# EAGLE design STM32_Rauch_002 (EAGLE 7.7.0)

## Sheet 1 of 2
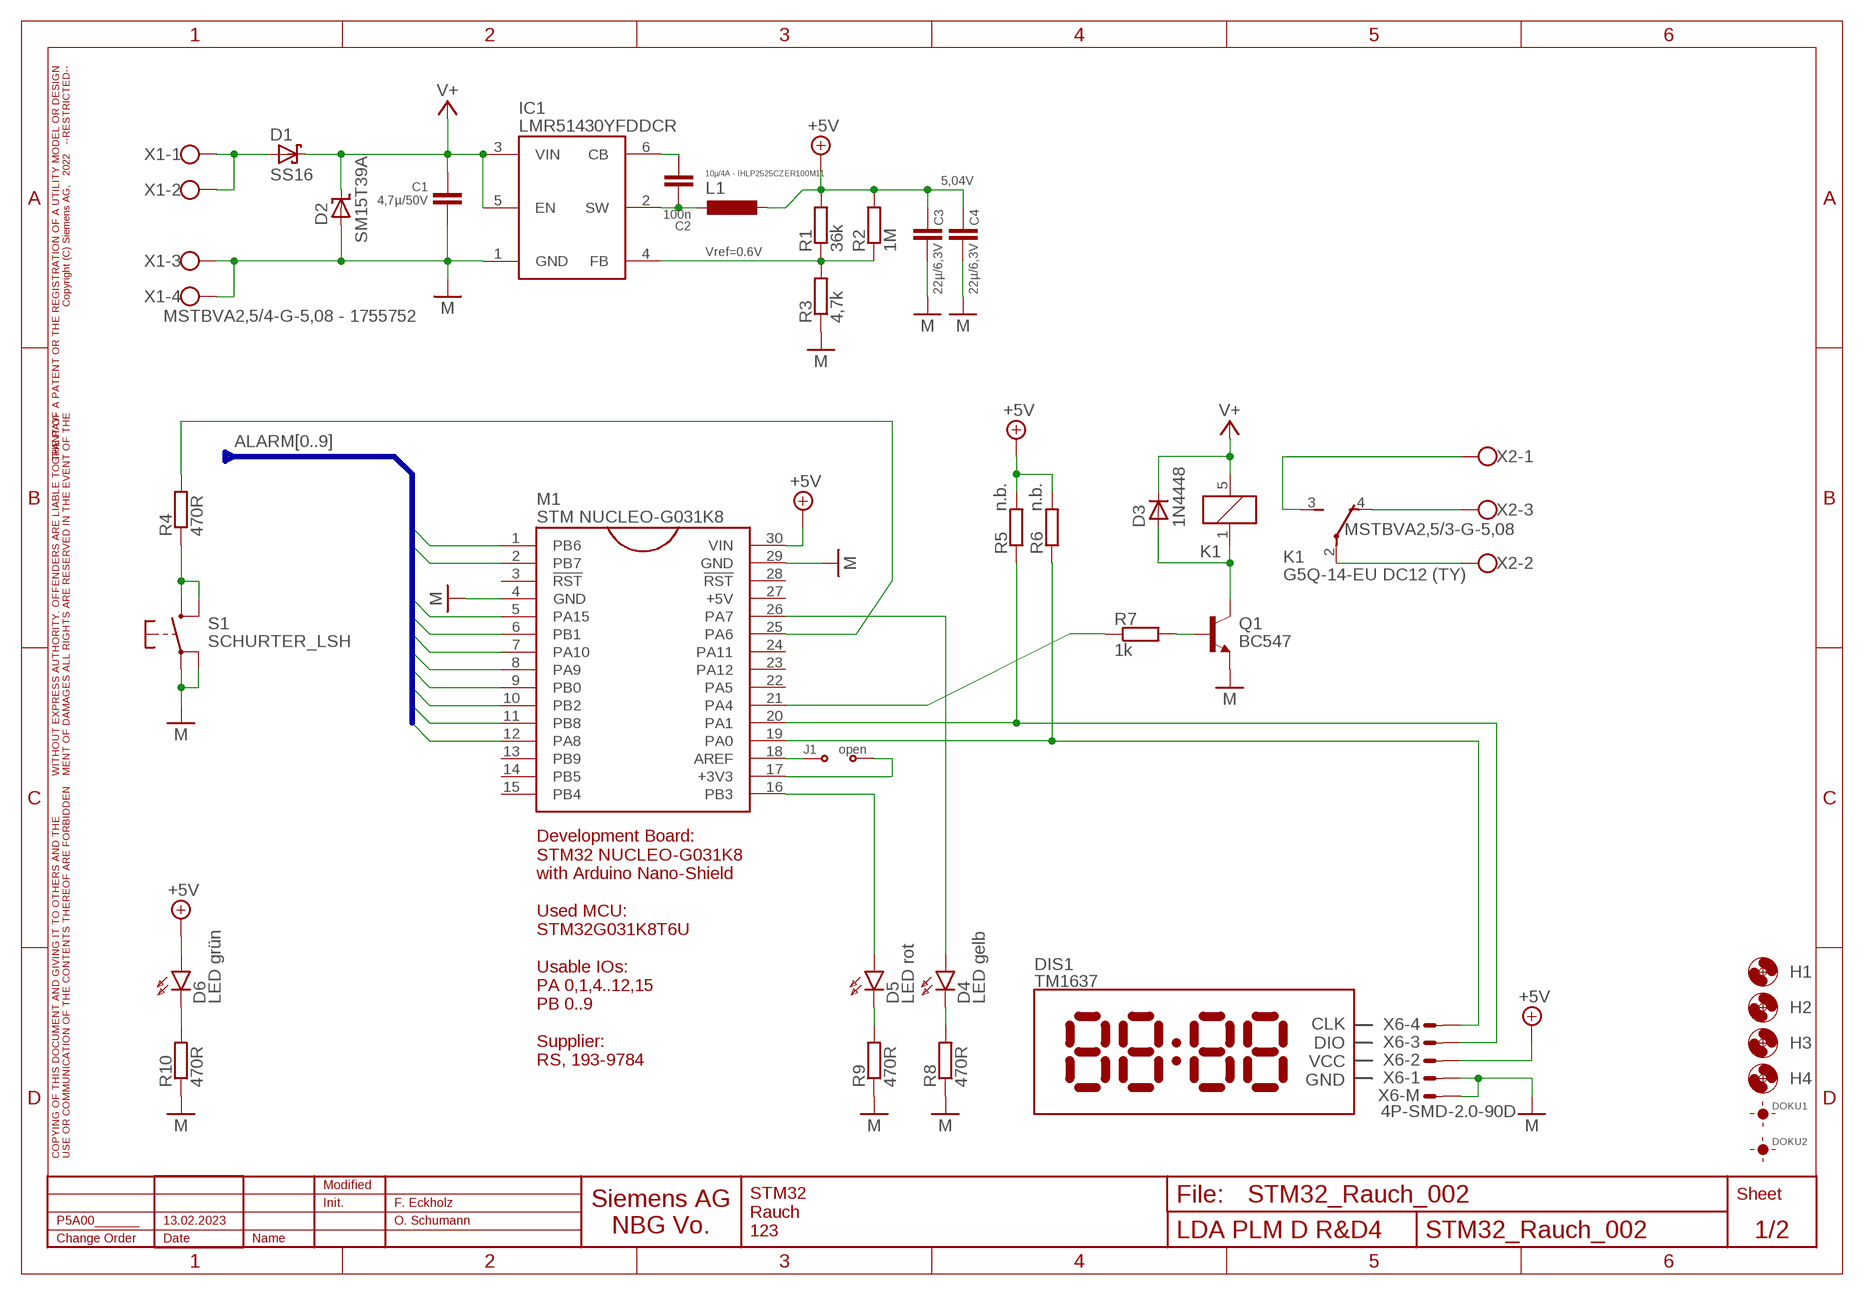
[diagram p0: schematic, sheet 1]

### Parts
C1  4,7µ/50V  C-EU1210  [CAPC1210]
C2  100n  C-EU0603  [CAPC0603]
C3  22µ/6,3V  C-EU1206  [CAPC1206]
C4  22µ/6,3V  C-EU1206  [CAPC1206]
D1  SS16  DIODE-SCHOTTKY-SMA  [DIOM-SMA]
D2  SM15T39A  DIODE-TVS-UNI-SMC  [DIOM-SMC]
D3  1N4448  DIODE-SOD323  [SOD323]
D4  LED gelb  DIODE-LED-C1608  [LEDC1608]
D5  LED rot  DIODE-LED-C1608  [LEDC1608]
D6  LED grün  DIODE-LED-C1608  [LEDC1608]
DIS1  TM1637  [TM1637]
DOKU1  PAD-FIDU-R200  [FIDU_RUND-2MM]
DOKU2  PAD-FIDU-R200  [FIDU_RUND-2MM]
DOKU4  STM32_Rauch_002  TEXT-50-TOP  [DOKU-50-TOP]
H1  MOUNT-HOLE-3.2  [MOUNT-HOLE-3,2]
H2  MOUNT-HOLE-3.2  [MOUNT-HOLE-3,2]
H3  MOUNT-HOLE-3.2  [MOUNT-HOLE-3,2]
H4  MOUNT-HOLE-3.2  [MOUNT-HOLE-3,2]
IC1  LMR51430YFDDCR  LMR51430  [SOT23-6]
J1  open  CON-J2D  [CON-SOLDERJUMPER]
K1  G5Q-14-EU DC12 (TY)  RELAIS1-OMRON-G5Q  [OMRON-G5Q]
L1  10µ/4A - IHLP2525CZER100M11  L-EU0707  [INDM0707]
M1  STM NUCLEO-G031K8  STM32-NUCLEO32  [NUCLEO32]
Q1  BC547  TRANSISTOR-NPN-SOT23  [SOT23]
R1  36k  R-EU_0603  [RESC0603]
R2  1M  R-EU_0603  [RESC0603]
R3  4,7k  R-EU_0603  [RESC0603]
R4  470R  R-EU_0603  [RESC0603]
R5  n.b.  R-EU_0603  [RESC0603]
R6  n.b.  R-EU_0603  [RESC0603]
R7  1k  R-EU_0603  [RESC0603]
R8  470R  R-EU_0603  [RESC0603]
R9  470R  R-EU_0603  [RESC0603]
R10  470R  R-EU_0603  [RESC0603]
S1  SCHURTER_LSH  [SHURTER_LSH]
X1  MSTBVA2,5/4-G-5,08 - 1755752  MSTBVA2,5/4-G-5,08  [MSTBVA2,5/4-G-5,08]
X2  MSTBVA2,5/3-G-5,08  [MSTBVA2,5/3-G-5,08]
X6  4P-SMD-2.0-90D  [4P-SMD-2.0-90D]

### Nets
!RESET: M1.25(PA6) R4.2
+5V: C3.2 C4.2 D6.2(A) L1.2 M1.30(VIN) R1.2 R2.2 R5.2 R6.2 X6.2 ; also sheet 2
ALARM0: M1.1(PB6) ; also sheet 2
ALARM1: M1.2(PB7) ; also sheet 2
ALARM2: M1.5(PA15) ; also sheet 2
ALARM3: M1.6(PB1) ; also sheet 2
ALARM4: M1.7(PA10) ; also sheet 2
ALARM5: M1.8(PA9) ; also sheet 2
ALARM6: M1.9(PB0) ; also sheet 2
ALARM7: M1.10(PB2) ; also sheet 2
ALARM8: M1.11(PB8) ; also sheet 2
ALARM9: M1.12(PA8) ; also sheet 2
M: C1.1 C3.1 C4.1 D2.2(A) IC1.1(GND) M1.4(GND) M1.29(GND) Q1.2(E) R3.1 R8.1 R9.1 R10.1 S1.1(P) S1.2(P) X1.3 X1.4 X6.1 X6.SS1 X6.SS2 ; also sheet 2
N$1: D3.A K1.1(C:COIL1) Q1.3(C)
N$2: D1.2(A) X1.1 X1.2
N$3: R4.1 S1.3(S) S1.4(S)
N$6: D4.1(C) R8.2
N$7: Q1.1(B) R7.2
N$8: D5.1(C) R9.2
N$9: M1.21(PA4) R7.1
N$10: C2.1 IC1.6(CB)
N$11: C2.2 IC1.2(SW) L1.1
N$12: IC1.4(FB) R1.1 R2.1 R3.2
N$13: K1.2(R:C) X2.2
N$14: K1.3(R:NO) X2.1
N$15: K1.4(R:NC) X2.3
N$16: M1.19(PA0) R6.1 X6.4
N$18: D6.1(C) R10.2
N$19: J1.1 M1.18(AREF)
N$20: M1.20(PA1) R5.1 X6.3
N$21: D4.2(A) M1.26(PA7)
N$30: D5.2(A) M1.16(PB3)
N$63: J1.2 M1.17(+3V3)
V+: C1.2 D1.1(K) D2.1(C) D3.C IC1.3(VIN) IC1.5(EN) K1.5(C:COIL2) ; also sheet 2
Unconnected: M1.3(!RST) M1.13(PB9) M1.14(PB5) M1.15(PB4) M1.22(PA5) M1.23(PA12) M1.24(PA11) M1.27(+5V) M1.28(!RST)

### Buses
ALARM[0..9]

### Notes on the sheet
- 5,04V
- Vref=0.6V
- Development Board:
  STM32 NUCLEO-G031K8
  with Arduino Nano-Shield
  
  Used MCU:
  STM32G031K8T6U
  
  Usable IOs:
  PA 0,1,4..12,15
  PB 0..9
  
  Supplier:
  RS, 193-9784
- F. Eckholz
- STM32
  Rauch
  123
- P5A00______ | 13.02.2023 | O. Schumann

## Sheet 2 of 2
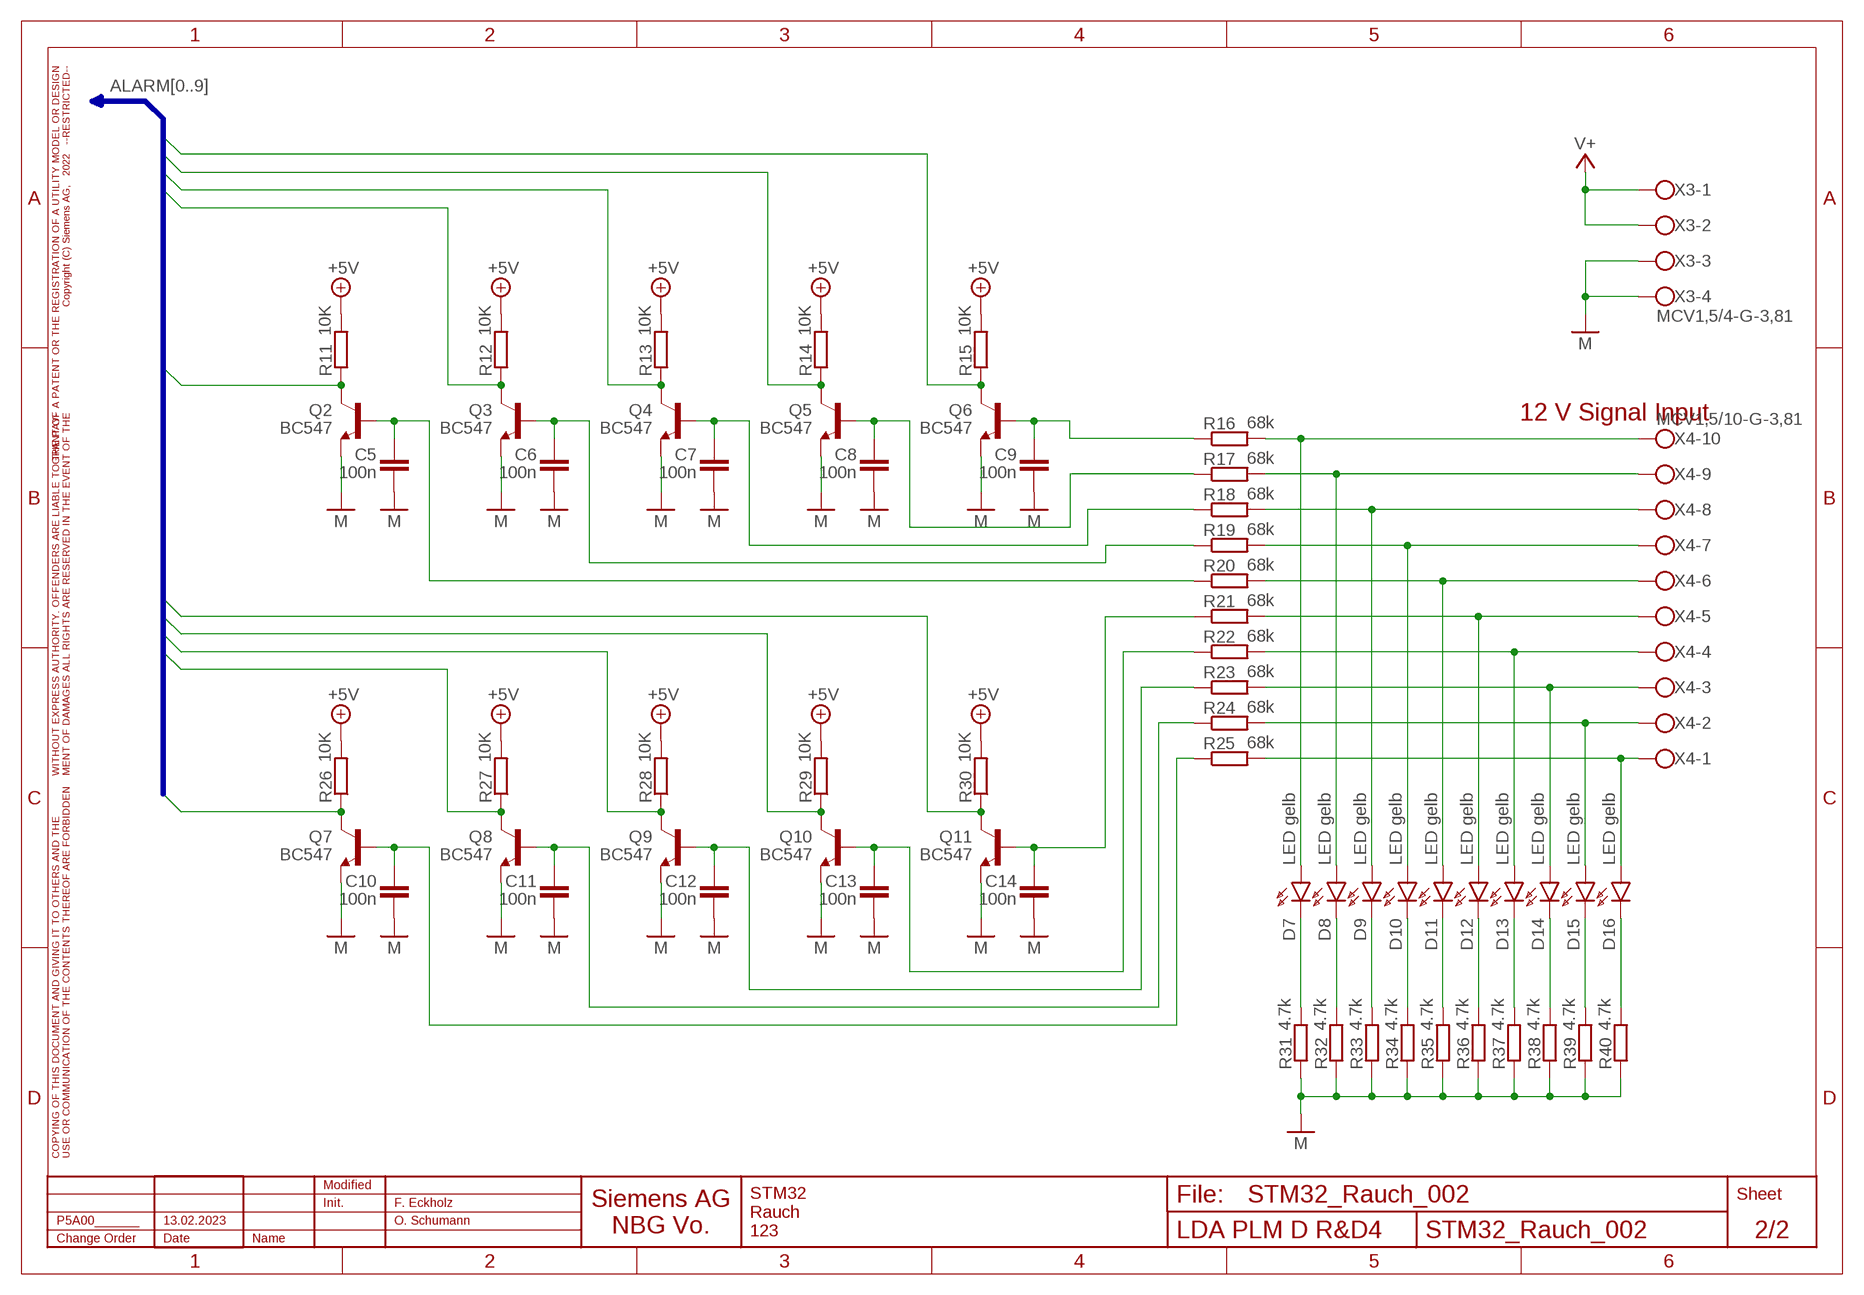
[diagram p1: schematic, sheet 2]

### Parts
C5  100n  C-EU0603  [CAPC0603]
C6  100n  C-EU0603  [CAPC0603]
C7  100n  C-EU0603  [CAPC0603]
C8  100n  C-EU0603  [CAPC0603]
C9  100n  C-EU0603  [CAPC0603]
C10  100n  C-EU0603  [CAPC0603]
C11  100n  C-EU0603  [CAPC0603]
C12  100n  C-EU0603  [CAPC0603]
C13  100n  C-EU0603  [CAPC0603]
C14  100n  C-EU0603  [CAPC0603]
D7  LED gelb  DIODE-LED-C1608  [LEDC1608]
D8  LED gelb  DIODE-LED-C1608  [LEDC1608]
D9  LED gelb  DIODE-LED-C1608  [LEDC1608]
D10  LED gelb  DIODE-LED-C1608  [LEDC1608]
D11  LED gelb  DIODE-LED-C1608  [LEDC1608]
D12  LED gelb  DIODE-LED-C1608  [LEDC1608]
D13  LED gelb  DIODE-LED-C1608  [LEDC1608]
D14  LED gelb  DIODE-LED-C1608  [LEDC1608]
D15  LED gelb  DIODE-LED-C1608  [LEDC1608]
D16  LED gelb  DIODE-LED-C1608  [LEDC1608]
Q2  BC547  TRANSISTOR-NPN-SOT23  [SOT23]
Q3  BC547  TRANSISTOR-NPN-SOT23  [SOT23]
Q4  BC547  TRANSISTOR-NPN-SOT23  [SOT23]
Q5  BC547  TRANSISTOR-NPN-SOT23  [SOT23]
Q6  BC547  TRANSISTOR-NPN-SOT23  [SOT23]
Q7  BC547  TRANSISTOR-NPN-SOT23  [SOT23]
Q8  BC547  TRANSISTOR-NPN-SOT23  [SOT23]
Q9  BC547  TRANSISTOR-NPN-SOT23  [SOT23]
Q10  BC547  TRANSISTOR-NPN-SOT23  [SOT23]
Q11  BC547  TRANSISTOR-NPN-SOT23  [SOT23]
R11  10K  R-EU_0603  [RESC0603]
R12  10K  R-EU_0603  [RESC0603]
R13  10K  R-EU_0603  [RESC0603]
R14  10K  R-EU_0603  [RESC0603]
R15  10K  R-EU_0603  [RESC0603]
R16  68k  R-EU_0603  [RESC0603]
R17  68k  R-EU_0603  [RESC0603]
R18  68k  R-EU_0603  [RESC0603]
R19  68k  R-EU_0603  [RESC0603]
R20  68k  R-EU_0603  [RESC0603]
R21  68k  R-EU_0603  [RESC0603]
R22  68k  R-EU_0603  [RESC0603]
R23  68k  R-EU_0603  [RESC0603]
R24  68k  R-EU_0603  [RESC0603]
R25  68k  R-EU_0603  [RESC0603]
R26  10K  R-EU_0603  [RESC0603]
R27  10K  R-EU_0603  [RESC0603]
R28  10K  R-EU_0603  [RESC0603]
R29  10K  R-EU_0603  [RESC0603]
R30  10K  R-EU_0603  [RESC0603]
R31  4.7k  R-EU_0603  [RESC0603]
R32  4.7k  R-EU_0603  [RESC0603]
R33  4.7k  R-EU_0603  [RESC0603]
R34  4.7k  R-EU_0603  [RESC0603]
R35  4.7k  R-EU_0603  [RESC0603]
R36  4.7k  R-EU_0603  [RESC0603]
R37  4.7k  R-EU_0603  [RESC0603]
R38  4.7k  R-EU_0603  [RESC0603]
R39  4.7k  R-EU_0603  [RESC0603]
R40  4.7k  R-EU_0603  [RESC0603]
X3  MCV1,5/4-G-3,81  [MCV1,5/4-G-3,81]
X4  MCV1,5/10-G-3,81  [MCV1,5/10-G-3,81]

### Nets
+5V: R11.2 R12.2 R13.2 R14.2 R15.2 R26.2 R27.2 R28.2 R29.2 R30.2 ; also sheet 1
ALARM0: Q6.3(C) R15.1 ; also sheet 1
ALARM1: Q5.3(C) R14.1 ; also sheet 1
ALARM2: Q4.3(C) R13.1 ; also sheet 1
ALARM3: Q3.3(C) R12.1 ; also sheet 1
ALARM4: Q2.3(C) R11.1 ; also sheet 1
ALARM5: Q11.3(C) R30.1 ; also sheet 1
ALARM6: Q10.3(C) R29.1 ; also sheet 1
ALARM7: Q9.3(C) R28.1 ; also sheet 1
ALARM8: Q8.3(C) R27.1 ; also sheet 1
ALARM9: Q7.3(C) R26.1 ; also sheet 1
M: C5.1 C6.1 C7.1 C8.1 C9.1 C10.1 C11.1 C12.1 C13.1 C14.1 Q2.2(E) Q3.2(E) Q4.2(E) Q5.2(E) Q6.2(E) Q7.2(E) Q8.2(E) Q9.2(E) Q10.2(E) Q11.2(E) R31.1 R32.1 R33.1 R34.1 R35.1 R36.1 R37.1 R38.1 R39.1 R40.1 X3.P$3 X3.P$4 ; also sheet 1
N$4: D7.2(A) R16.2 X4.P$10
N$5: D7.1(C) R31.2
N$17: C14.2 Q11.1(B) R21.1
N$22: D14.2(A) R23.2 X4.P$3
N$23: C13.2 Q10.1(B) R22.1
N$24: D8.2(A) R17.2 X4.P$9
N$25: D9.2(A) R18.2 X4.P$8
N$26: D10.2(A) R19.2 X4.P$7
N$27: D11.2(A) R20.2 X4.P$6
N$28: D12.2(A) R21.2 X4.P$5
N$29: D13.2(A) R22.2 X4.P$4
N$31: D15.2(A) R24.2 X4.P$2
N$32: D16.2(A) R25.2 X4.P$1
N$34: D8.1(C) R32.2
N$35: D9.1(C) R33.2
N$36: D10.1(C) R34.2
N$37: D11.1(C) R35.2
N$38: D12.1(C) R36.2
N$39: D13.1(C) R37.2
N$41: C12.2 Q9.1(B) R23.1
N$42: D14.1(C) R38.2
N$44: D15.1(C) R39.2
N$46: C11.2 Q8.1(B) R24.1
N$47: D16.1(C) R40.2
N$50: C9.2 Q6.1(B) R16.1
N$53: C8.2 Q5.1(B) R17.1
N$56: C7.2 Q4.1(B) R18.1
N$59: C6.2 Q3.1(B) R19.1
N$62: C10.2 Q7.1(B) R25.1
N$66: C5.2 Q2.1(B) R20.1
V+: X3.P$1 X3.P$2 ; also sheet 1

### Buses
ALARM[0..9]

### Notes on the sheet
- 12 V Signal Input
- F. Eckholz
- STM32
  Rauch
  123
- P5A00______ | 13.02.2023 | O. Schumann

## Library data of the parts
C1-C14 = rcl smd:C-EU: CAPACITOR, European symbol
D1 = diode:DIODE-SCHOTTKY
D2 = diode:DIODE-TVS-UNI
D3 = diode:DIODE
D4-D16 = diode:DIODE-LED
DIS1 = Arduino:TM1637: TM1637
DOKU1 DOKU2 = info:PAD-FIDU: Fiducial = Passermarke Auszug aus: "R 5.4.4 Automatengerechtes Design von Leiterplatten" der Firma Bischof Elektronik Rev 0 Optische Marken für Leiterplatten-Lageerkennung - Anordnung von mind. 2 Marken pro Einzelschaltung bei SMD-bestückten Layern - zusätzlich min. 2 Marken , möglichst 4 auf technolog. Rand bei Nutzen-Gestaltung, jedoch nicht symmetriesch wegen Verdrehgefahr beim Einstapeln der LP in Magazin - Marken möglichst diagonal mit größtmöglichem Abstand positionieren, jedoch nicht im o.g. Randbereich von 5 mm - alle Referenzmarken einer Leiterplatte sollten möglichst gleiche Geometrie haben - bei großen hochpoligen Fine-Pitch-Bauteilen sind je Bauteil 2 zusätzliche, lokale Referenzmarken in unmittelbarer Nähe und möglichst diagonal-symetrisch anzuordnen Markenform: Vollkreis oder Vollquadrat 1 bis 2,0 mm sind am günstigsten keine Überdeckung mit Lötstoplack; Lötstopp-Lackfrei ca. Durchmesser 5 mm Leiterbildstrukturen sollten einen Mindestabstand von 5mm zur Marke einhalten.; BOM: EXCLUDE
DOKU4 = frames:TEXT: Textfeld für Dokumentation Als Value im Schaltplan und Board; BOM: EXCLUDE
H1-H4 = con-pad:MOUNT-HOLE: Mounting Hole
IC1 = sda_test:LMR51430: LMR51430 SIMPLE SWITCHER® 4.5-V to 36-V, 3-A, Synchronous Buck Converter in a SOT-23 Package Part Number Frequency Mode LMR51430XDDCR 500 kHz PFM LMR51430XFDDCR 500 kHz FPWM LMR51430YDDCR 1.1 MHz PFM LMR51430YFDDCR 1.1 MHz FPWM
J1 = con-div:CON-J2: Jumper 2pol.
K1 = relais:RELAIS1
L1 = rcl smd:L-EU: INDUCTOR, European symbol
M1 = Arduino:STM32: Arduino Nano plug in module with SMT32 Nucleo-32 signal names
Q1-Q11 = transistor:TRANSISTOR-NPN
R1-R40 = rcl smd:R-EU_: RESISTOR, European symbol
S1 = switch:SCHURTER
X1 = con-phoenix:MSTBVA2,5/4-G-5,08: Phoenix Contact Artikelbezeichnung MSTBVA2,5/4-G-5,08 Artikelnummer 1755752 COMBICON-Typ Grundgehäuse Anschlussdaten 320V 12A Rastermaß [mm] 5,08 Im Raster anreihbar nein Maximale Bauhöhe [mm] siehe Gegenstück o.schumann@isle-ilmenau.de
X2 = con-phoenix:MSTBVA2,5/3-G-5,08: Phoenix Contact Artikelbezeichnung MSTBVA2,5/3-G-5,08 Artikelnummer 1755749 COMBICON-Typ Grundgehäuse Anschlussdaten 320V 12A Rastermaß [mm] 5,08 Im Raster anreihbar nein Maximale Bauhöhe [mm] siehe Gegenstück o.schumann@isle-ilmenau.de
X3 = con-phoenix:MCV1,5/4-G-3,81: Phoenix Contact Artikelbezeichnung MCV 1,5/4-G-3,81 Artikelnummer 1803442 COMBICON-Typ Printklemme Anschlussdaten 160V 8A Rastermaß [mm] 3,81 Im Raster anreihbar nein Maximale Bauhöhe [mm] keine Ahnung o.schumann@isle-ilmenau.de
X4 = con-phoenix:MCV1,5/10-G-3,81: Phoenix Contact Artikelbezeichnung MCV 1,5/10-G-3,81 Artikelnummer 1803507 COMBICON-Typ Printklemme Anschlussdaten 160V 8A Rastermaß [mm] 3,81 Im Raster anreihbar nein Maximale Bauhöhe [mm] keine Ahnung oliver.schumann@siemens.com
X6 = Arduino:4P-SMD-2.0-90D

## Net classes
0 default: width 0.3 mm, drill 0.3 mm, clearance 0.203 mm
1 Diff_pair: clearance 0.152 mm

## Board
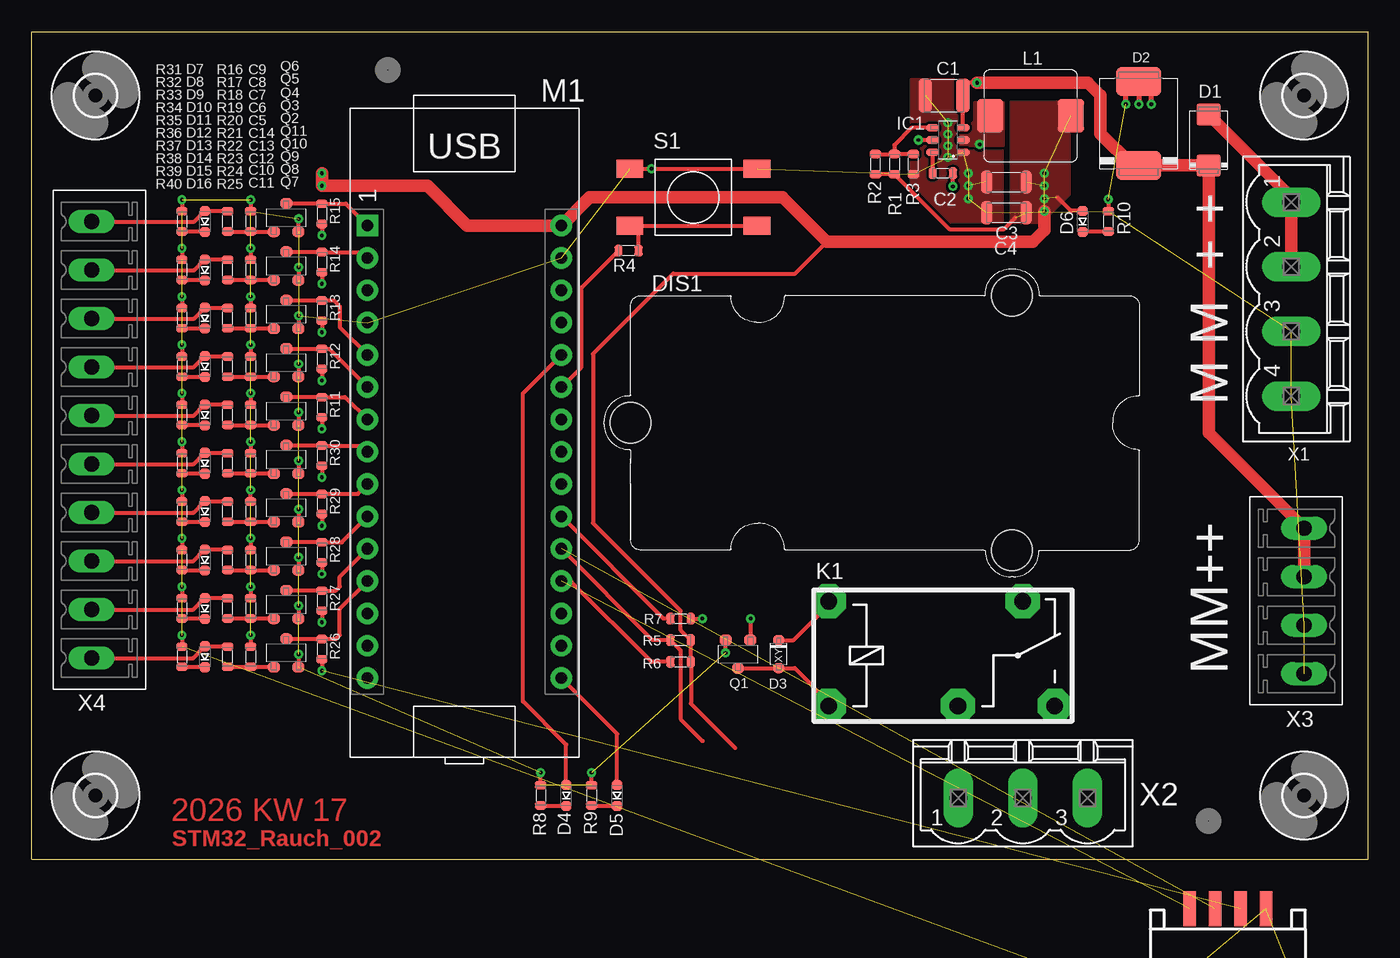
[diagram p2: board, top side]
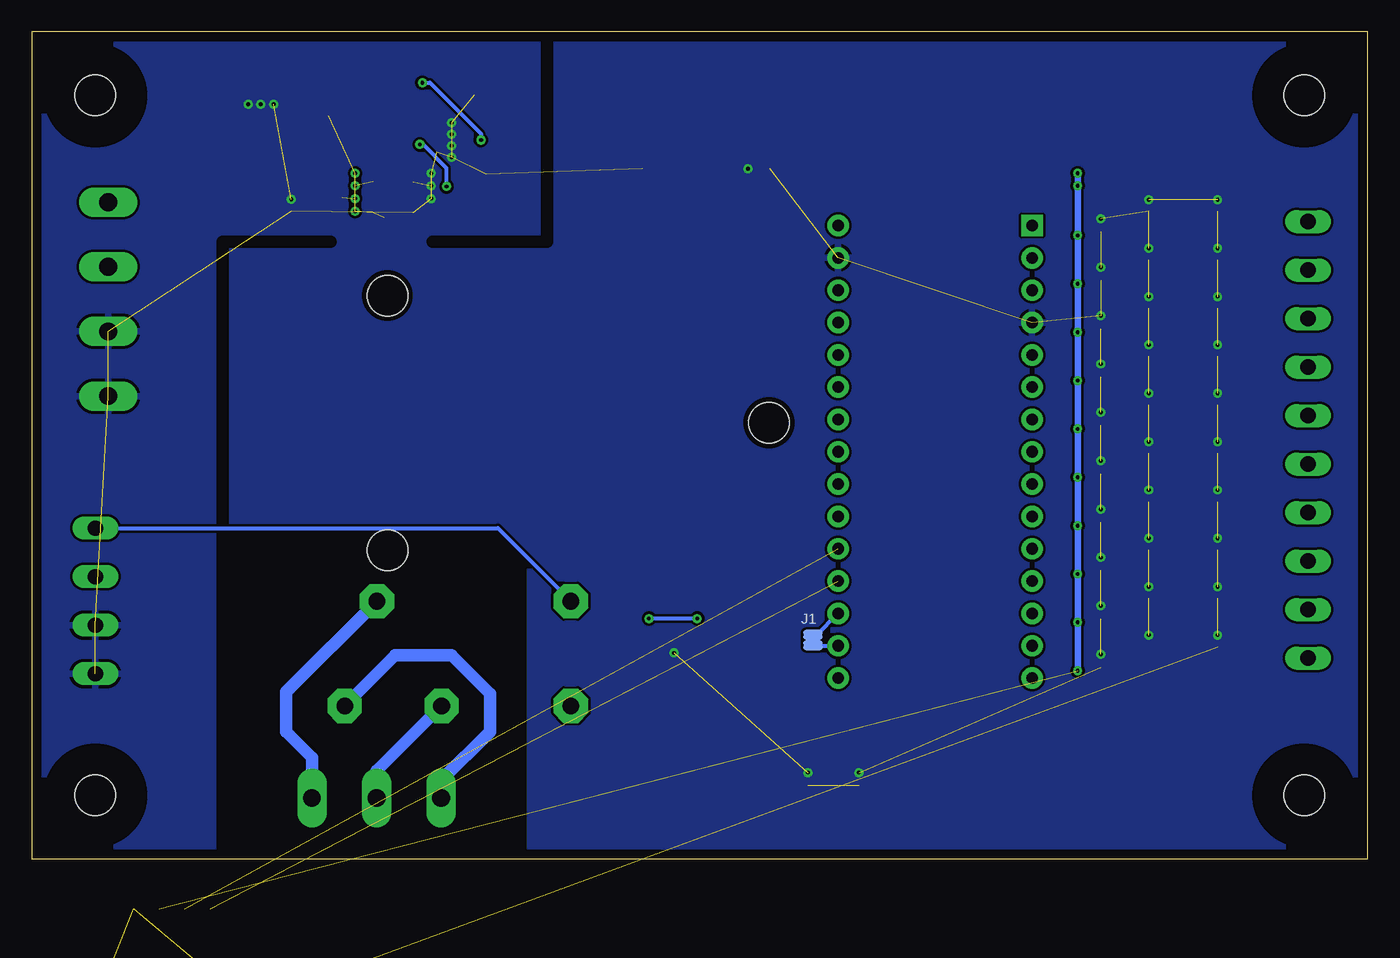
[diagram p3: board, bottom side, seen from below]

Size 105 x 65 mm. Coordinates in mm from the lower left corner, seen from the top.
Outline: 0,0 0,65 105,65 105,0 0,0
Copper layers (1+16): Top 0.035mm / dielectric 0.36mm / Bottom 0.035mm
Design rules "default *": minimum track width 0.1mm, minimum drill 0.3mm, track to track 6mil, track to pad 6mil, pad to pad 8mil, via to via 8mil, smd to smd 8mil, copper to edge 0.4mm, drill to drill 8mil, minimum pad ring 10mil, minimum via ring 8mil, stop-mask expansion 4mil, vias tented up to drill 0mil, thermal gap 10mil
tRestrict: 3 lines
bRestrict: 6 lines

### Footprints (pad centres in the part's own frame; a part is rotated, then mirrored left to right if it is on the bottom)
CAPC1210 = smd 1.04 x 2.667: 1 -1.48,0; 2 1.48,0
CAPC0603 = smd 0.635 x 0.889: 1 -0.794,0; 2 0.794,0
CAPC1206 = smd 0.889 x 1.841: 1 -1.556,0; 2 1.556,0
DIOM-SMA = smd 1.7 x 1.85: 1 -2,0; 2 2,0
DIOM-SMC = smd 2.286 x 3.556: 1 -3.302,0; 2 3.302,0
SOD323 = smd 0.78 x 0.85: A 1.101,0; C -1.101,0
LEDC1608 = smd 0.8 x 0.8: 1 -0.825,0; 2 0.825,0
TM1637 = hole 3.2: 10.453,-10.42; 10.453,9.58; -19.535,-0.415
MOUNT-HOLE-3,2 = hole 3.2: 0,0
SOT23-6 = smd 1.027 x 0.6: 1 -1.2,0.95; 2 -1.2,0; 3 -1.2,-0.95; 4 1.2,-0.95; 5 1.2,0; 6 1.2,0.95
CON-SOLDERJUMPER = smd 1.5 x 0.75: 1 0,0.425; 2 0,-0.4
OMRON-G5Q = drill 1.3 pad 2.7 octagon: 1 -8.97,-3.96; 2 1.19,-3.96; 3 8.81,-3.96; 4 6.27,4.26; 5 -8.97,4.26
INDM0707 = smd 2.05 x 2.6: 1 -3.175,0; 2 3.175,0
NUCLEO32 = drill 0.914 pad 1.676 square: 1 -7.62,17.78 | drill 0.914 pad 1.676: 2 -7.62,15.24; 3 -7.62,12.7; 4 -7.62,10.16; 5 -7.62,7.62; 6 -7.62,5.08; 7 -7.62,2.54; 8 -7.62,0; 9 -7.62,-2.54; 10 -7.62,-5.08; 11 -7.62,-7.62; 12 -7.62,-10.16; 13 -7.62,-12.7; 14 -7.62,-15.24; 15 -7.62,-17.78; 16 7.62,-17.78; 17 7.62,-15.24; 18 7.62,-12.7; 19 7.62,-10.16; 20 7.62,-7.62; 21 7.62,-5.08; 22 7.62,-2.54; 23 7.62,0; 24 7.62,2.54; 25 7.62,5.08; 26 7.62,7.62; 27 7.62,10.16; 28 7.62,12.7; 29 7.62,15.24; 30 7.62,17.78
SOT23 = smd 0.813 x 0.909: 1 -1.118,0.965; 2 -1.118,-0.965; 3 1.118,0
RESC0603 = smd 0.635 x 0.889: 1 -0.794,0; 2 0.794,0
SHURTER_LSH = smd 2.1 x 1.4: 1 -5,2.25; 2 5,2.25; 3 -5,-2.25; 4 5,-2.25
MSTBVA2,5/4-G-5,08 = drill 1.4 pad 2.3 long: 1 -7.62,0; 2 -2.54,0; 3 2.54,0; 4 7.62,0
MSTBVA2,5/3-G-5,08 = drill 1.4 pad 2.3 long: 1 -5.08,0; 2 0,0; 3 5.08,0
MCV1,5/4-G-3,81 = drill 1.2 long: P$1 0,0; P$2 3.81,0; P$3 7.62,0; P$4 11.43,0
MCV1,5/10-G-3,81 = drill 1.2 long: P$1 0,0; P$2 3.81,0; P$3 7.62,0; P$4 11.43,0; P$5 15.24,0; P$6 19.05,0; P$7 22.86,0; P$8 26.67,0; P$9 30.48,0; P$10 34.29,0
4P-SMD-2.0-90D = smd 0.965 x 2.74: 1 -3,-0.1; 2 -1,-0.1; 3 1,-0.1; 4 3,-0.1 | smd 2.159 x 2.184: SS1 -5.974,7.4; SS2 5.974,7.4

### Placement (x,y rotation side)
C1  71.7,60 0 top
C2  71.6,53.9 0 top
C3  76.6,53.2 0 top
C4  76.6,50.8 0 top
C5  17.2,34.9 270 top
C6  17.2,38.7 270 top
C7  17.2,42.5 270 top
C8  17.2,46.3 270 top
C9  17.2,50.1 270 top
C10  17.2,15.9 270 top
C11  17.2,19.7 270 top
C12  17.2,23.5 270 top
C13  17.2,27.3 270 top
C14  17.2,31.1 270 top
D1  92.5,56.5 90 top
D2  87,57.8 90 top
D3  58.7,16.1 270 top
D4  42,5 90 top
D5  46,5 90 top
D6  82.6,50.1 90 top
D7  13.6,50.1 90 top
D8  13.6,46.3 90 top
D9  13.6,42.5 90 top
D10  13.6,38.7 90 top
D11  13.6,34.9 90 top
D12  13.6,31.1 90 top
D13  13.6,27.3 90 top
D14  13.6,23.5 90 top
D15  13.6,19.7 90 top
D16  13.6,15.9 90 top
DIS1  66.6,34.7 0 top
DOKU1  28,62 0 top
DOKU2  92.5,3 0 top
DOKU4  11,1 0 top
H1  5,5 0 top
H2  5,60 0 top
H3  100,5 0 top
H4  100,60 0 top
IC1  72,56.5 180 top
J1  43.6,17.2 0 bottom
K1  71.6,16 0 top
L1  78.5,58.4 0 top
M1  34,32 0 top
Q1  55.5,16.1 270 top
Q2  20,35.2 90 top
Q3  20,39 90 top
Q4  20,42.8 90 top
Q5  20,46.6 90 top
Q6  20,50.4 90 top
Q7  20,16.2 90 top
Q8  20,20 90 top
Q9  20,23.8 90 top
Q10  20,27.6 90 top
Q11  20,31.4 90 top
R1  67.8,54.6 270 top
R2  66.3,54.6 270 top
R3  69.3,54.6 90 top
R4  46.9,47.8 180 top
R5  51,17.2 0 top
R6  51,15.5 0 top
R7  51,18.9 0 top
R8  40,5 270 top
R9  44,5 270 top
R10  84.6,50.1 270 top
R11  22.8,35.5 270 top
R12  22.8,39.3 270 top
R13  22.8,43.1 270 top
R14  22.8,46.9 270 top
R15  22.8,50.7 270 top
R16  15.4,50.1 90 top
R17  15.4,46.3 90 top
R18  15.4,42.5 90 top
R19  15.4,38.7 90 top
R20  15.4,34.9 90 top
R21  15.4,31.1 90 top
R22  15.4,27.3 90 top
R23  15.4,23.5 90 top
R24  15.4,19.7 90 top
R25  15.4,15.9 90 top
R26  22.8,16.5 270 top
R27  22.8,20.3 270 top
R28  22.8,24.1 270 top
R29  22.8,27.9 270 top
R30  22.8,31.7 270 top
R31  11.8,50.1 270 top
R32  11.8,46.3 270 top
R33  11.8,42.5 270 top
R34  11.8,38.7 270 top
R35  11.8,34.9 270 top
R36  11.8,31.1 270 top
R37  11.8,27.3 270 top
R38  11.8,23.5 270 top
R39  11.8,19.7 270 top
R40  11.8,15.9 270 top
S1  52,52 0 top
X1  99,44 270 top
X2  77.9,4.8 0 top
X3  100,26 270 top
X4  4.7,15.8 90 top
X6  94,-4 180 top  (outside the outline)

### Tracks (layer width: path | path; a pad name or v marks a point on that pad's centre or on a via)
!RESET
  Top 0.3: R4.2 43.2,44.89 43.2,38.66 M1.25
+5V  (via drill 0.3)  (9 unrouted)
  Top 0.3: R2.2 R1.2 72.11,49.5 76.4,49.5 77.3,50.4 | R26.2 v22.8,14.8 | R27.2 v22.8,18.6 | R28.2 v22.8,22.4 | R30.2 v22.8,30 | R29.2 v22.8,26.2 | R11.2 v22.8,33.8 | R12.2 v22.8,37.6 | R13.2 v22.8,41.4 | R14.2 v22.8,45.2 | R15.2 v22.8,49 | D6.2 81.67,50.92 80.6,52 | 55.27,8.73 51.79,12.21 R6.2 R5.2 51,17.99 51,19.5 44.1,26.4 44.1,39.7 50.4,46 60,46 62.5,48.5
  Top 1: v79.6,50.9 79.6,49.4 78.7,48.5 62.5,48.5 59,52 43.84,52 M1.30 34.22,49.78 31.1,52.9 v22.8,52.9 v22.8,53.9
  Bottom 0.5: v22.8,14.8 v22.8,18.6 v22.8,22.4 v22.8,26.2 v22.8,30 v22.8,33.8 v22.8,37.6 v22.8,41.4 v22.8,45.2 v22.8,49 v22.8,52.9 v22.8,53.9
  other vias: 79.6,53.9 79.6,52.9 79.6,51.9
  pour Top (rank 2, no thermals): 76.9,50 79.4,50 81.6,52.2 81.6,59.5 76.9,59.5
ALARM0
  Top 0.3: Q6.3 22.78,51.52 R15.1 24.67,51.49 M1.1
ALARM1
  Top 0.3: Q5.3 22.78,47.72 R14.1 25.93,47.69 M1.2
ALARM2
  Top 0.3: Q4.3 22.78,43.92 R13.1 23.71,43.89 24.2,43.4 24.2,41.8 M1.5
ALARM3
  Top 0.3: Q3.3 22.78,40.12 R12.1 23.37,40.09 M1.6
ALARM4
  Top 0.3: Q2.3 22.78,36.32 R11.1 24.63,36.29 M1.7
ALARM5
  Top 0.3: Q11.3 22.78,32.52 R30.1 25.89,32.49 M1.8
ALARM6
  Top 0.3: Q10.3 22.78,28.72 R29.1 25.61,28.69 M1.9
ALARM7
  Top 0.3: Q9.3 22.78,24.92 R28.1 24.35,24.89 M1.10
ALARM8
  Top 0.3: Q8.3 22.78,21.12 R27.1 23.89,21.09 24.2,21.4 24.2,22.2 M1.11
ALARM9
  Top 0.3: Q7.3 22.78,17.32 R26.1 23.89,17.29 24.2,17.6 24.2,19.66 M1.12
M  (via drill 0.3)  (56 unrouted)
  Top 0.3: R8.1 v40,6.8 | R9.1 v44,6.8 | S1.1 v48.7,54.25 S1.2 | v84.6,51.85 R10.1 | v54.53,16.2 Q1.2 | Q6.2 v20.96,50.3 | v20.96,46.5 Q5.2 | v17.2,48 C8.1 | v11.8,48 R32.1 | v11.8,44.2 R33.1 | v17.2,51.8 C9.1 | v11.8,51.8 R31.1 | v17.2,44.2 C7.1 | v20.96,42.7 Q4.2 | v17.2,40.4 C6.1 | v20.96,38.9 Q3.2 | v11.8,40.4 R34.1 | v11.8,36.6 R35.1 | v17.2,36.6 C5.1 | v20.96,35.1 Q2.2 | v17.2,32.8 C14.1 | v20.96,31.3 Q11.2 | v11.8,32.8 R36.1 | v11.8,29 R37.1 | v11.8,25.2 R38.1 | v17.2,25.2 C12.1 | v20.96,27.5 Q10.2 | v20.96,23.7 Q9.2 | v20.96,19.9 Q8.2 | v17.2,21.4 C11.1 | v11.8,21.4 R39.1 | v11.8,17.6 R40.1 | v17.2,17.6 C10.1 | v20.96,16.1 Q7.2 | C13.1 v17.2,29
  Top 0.406: v87,59.3 D2.2 87,60.8 | v88,59.3 88,60.8 87,60.8 | v86,59.3 86,60.8 87,60.8
  other vias: 73.6,53.9 73.6,52.9 73.6,51.9 72,56.95 72,57.85 72,56.05 72,55.15
  pour Top (rank 3, no thermals): 76.3,50 69.1,50 69.1,61.3 76.3,61.3
  pour Bottom: 1,1 104,1 104,64 1,64
N$1
  Top 0.3: Q1.3 58.68,14.98 D3.A 59.97,15 62.63,12.34 K1.1
N$2
  Top 1: X1.2 X1.1 99,52 D1.2
N$3
  Top 0.3: S1.3 48,49.75 | 48,49.75 S1.4 | R4.1 47.69,49.44 48,49.75
N$4
  Top 0.3: R16.2 15.4,50.92 D7.2 12.77,50.09 X4.P$10
N$5
  Top 0.3: D7.1 11.8,49.27 R31.2
N$6
  Top 0.3: R8.2 40.03,4.17 D4.1
N$7  (via drill 0.3)
  Top 0.3: R7.2 v52.7,18.9 | v56.5,18.9 56.5,17.25 Q1.1
  Bottom 0.3: v52.7,18.9 v56.5,18.9
N$8
  Top 0.3: R9.2 44.03,4.17 D5.1
N$9
  Top 0.3: R7.1 49.64,18.9 M1.21
N$10
  Top 0.3: IC1.6 C2.1
N$11  (via drill 0.3)
  Top 0.3: v72.4,52.85 C2.2
  Bottom 0.3: v74.5,56.15 74.25,56.15 72.4,54.3 v72.4,52.85
  pour Top (no thermals): 76.35,56 73,56 73,57.5 73.6,57.5 74.1,58 74.1,59.5 76.35,59.5
N$12
  Top 0.3: R3.2 R1.1 | R2.1 R1.1 | IC1.4 69.15,57.45 67.8,56.1 R1.1
N$13
  Bottom 1: X2.2 77.9,6.93 K1.2
N$14
  Bottom 1: X2.1 72.82,6.18 69,10 69,13 72,16 76.45,16 K1.3
N$15
  Bottom 1: X2.3 82.98,7.98 85,10 85,13.13 K1.4
N$16  (1 unrouted)
  Top 0.3: M1.19 41.66,21.8 42.4,21.8 48.7,15.5 R6.1 50.19,15.48
N$17
  Top 0.3: R21.1 C14.2 19.04,30.31 Q11.1
N$18
  Top 0.3: R10.2 82.57,49.31 D6.1
N$19
  Bottom 0.3: J1.1 43.3,17.62 M1.18
N$20  (1 unrouted)
  Top 0.3: M1.20 48.8,17.2 R5.1 51,16.41 51,11 52.73,9.27
N$21
  Top 0.3: D4.2 42,9 38.6,12.4 38.6,36.6 M1.26
N$22
  Top 0.3: R23.2 15.4,24.32 D14.2 12.7,23.42 X4.P$3
N$23
  Top 0.3: R22.1 C13.2 19.04,26.51 Q10.1
N$24
  Top 0.3: R17.2 15.4,47.12 D8.2 12.75,46.28 X4.P$9
N$25
  Top 0.3: R18.2 15.4,43.33 D9.2 12.75,42.47 X4.P$8
N$26
  Top 0.3: R19.2 15.4,39.52 D10.2 12.73,38.66 X4.P$7
N$27
  Top 0.3: R20.2 15.4,35.73 D11.2 12.72,34.85 X4.P$6
N$28
  Top 0.3: R21.2 15.4,31.93 D12.2 12.71,31.04 X4.P$5
N$29
  Top 0.3: R22.2 15.4,28.12 D13.2 12.71,27.23 X4.P$4
N$30
  Top 0.3: D5.2 46,9.84 M1.16
N$31
  Top 0.3: R24.2 15.4,20.52 D15.2 12.69,19.61 X4.P$2
N$32
  Top 0.3: R25.2 15.4,16.73 D16.2 12.68,15.8 X4.P$1
N$34
  Top 0.3: D8.1 11.8,45.48 R32.2
N$35
  Top 0.3: D9.1 11.8,41.67 R33.2
N$36
  Top 0.3: D10.1 11.8,37.88 R34.2
N$37
  Top 0.3: D11.1 11.8,34.08 R35.2
N$38
  Top 0.3: D12.1 11.8,30.27 R36.2
N$39
  Top 0.3: D13.1 11.8,26.48 R37.2
N$41
  Top 0.3: R23.1 C12.2 19.04,22.71 Q9.1
N$42
  Top 0.3: D14.1 11.8,22.68 R38.2
N$44
  Top 0.3: D15.1 11.8,18.88 R39.2
N$46
  Top 0.3: R24.1 C11.2 19.04,18.91 Q8.1
N$47
  Top 0.3: D16.1 11.8,15.07 R40.2
N$50
  Top 0.3: R16.1 C9.2 19.04,49.31 Q6.1
N$53
  Top 0.3: R17.1 C8.2 19.04,45.51 Q5.1
N$56
  Top 0.3: R18.1 C7.2 19.04,41.71 Q4.1
N$59
  Top 0.3: R19.1 C6.2 19.04,37.91 Q3.1
N$62
  Top 0.3: R25.1 C10.2 19.04,15.11 Q7.1
N$63
  Bottom 0.3: J1.2 43.56,16.76 M1.17
N$66
  Top 0.3: R20.1 C5.2 19.01,34.11 Q2.1
V+  (via drill 0.3)
  Top 0.3: IC1.5 v69.7,56.5 | IC1.3 73.18,57.47 C1.2 73.3,60.12 73.3,60.6 73.7,61 v74.3,61 | D3.C 59.87,17.2 62.63,19.96 K1.5
  Top 1: D2.1 | D2.1 D1.1 92.5,33.5 X3.P$1 X3.P$2 | v74.3,61 83,61 84,60 84,57 86.5,54.5 D2.1
  Bottom 0.3: v69.7,56.5 69.7,57 73.7,61 v74.3,61 | X3.P$1 68.37,26 K1.5

### Text on the board
Top: 2026 KW 17
tPlace: M M + + | MM++